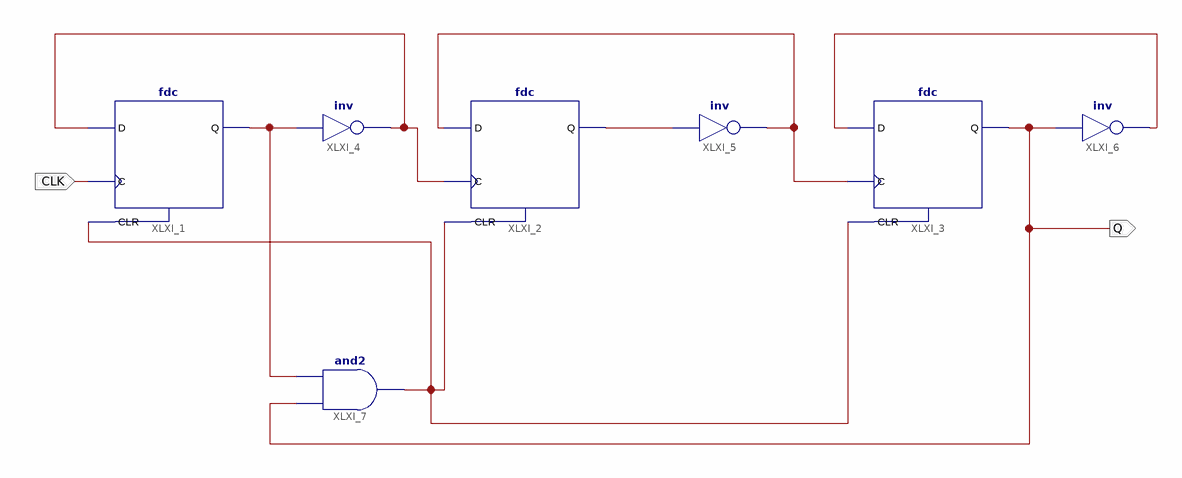
[diagram p0: schematic sheet 1]
// Xilinx ISE schematic CLK_div5.sch (spartan6) as structural Verilog: 7 symbols, 2 ports
module CLK_div5 (
  input  CLK,
  output Q
);

  wire XLXN_4, XLXN_8, XLXN_9, XLXN_14, XLXN_16, XLXN_17;

  fdc XLXI_1 (.C(CLK), .CLR(XLXN_17), .D(XLXN_8), .Q(XLXN_16));
  fdc XLXI_2 (.C(XLXN_8), .CLR(XLXN_17), .D(XLXN_9), .Q(XLXN_4));
  fdc XLXI_3 (.C(XLXN_9), .CLR(XLXN_17), .D(XLXN_14), .Q(Q));
  not XLXI_4 (XLXN_8, XLXN_16);
  not XLXI_5 (XLXN_9, XLXN_4);
  not XLXI_6 (XLXN_14, Q);
  and XLXI_7 (XLXN_17, Q, XLXN_16);
endmodule
